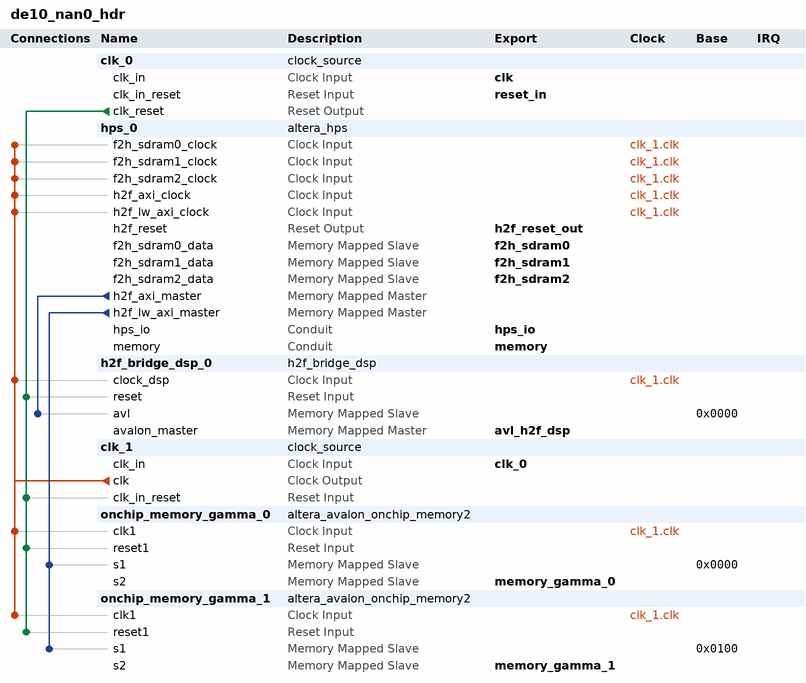
[diagram p0: system contents]
# Platform Designer (Qsys) system de10_nan0_hdr, Cyclone V 5CSEBA6U23I7
# Parameters at their usual value, and those the tool derives, are not listed.
package require -exact qsys 17.1
create_system de10_nan0_hdr
set_project_property DEVICE_FAMILY {Cyclone V}
set_project_property DEVICE 5CSEBA6U23I7

add_instance clk_0 clock_source 17.1
set_instance_parameter_value clk_0 clockFrequency 50000000

add_instance hps_0 altera_hps 17.1
set_instance_parameter_value hps_0 EMAC1_Mode RGMII
set_instance_parameter_value hps_0 EMAC1_PinMuxing {HPS I/O Set 0}
set_instance_parameter_value hps_0 F2SCLK_COLDRST_Enable false
set_instance_parameter_value hps_0 F2SCLK_DBGRST_Enable false
set_instance_parameter_value hps_0 F2SCLK_WARMRST_Enable false
set_instance_parameter_value hps_0 F2SDRAM_Type {Avalon-MM Write-Only,Avalon-MM Read-Only,Avalon-MM Write-Only}
set_instance_parameter_value hps_0 F2SDRAM_Width 64,32,32
set_instance_parameter_value hps_0 F2SINTERRUPT_Enable false
set_instance_parameter_value hps_0 F2S_Width 0
set_instance_parameter_value hps_0 FPGA_PERIPHERAL_OUTPUT_CLOCK_FREQ_EMAC0_GTX_CLK 125
set_instance_parameter_value hps_0 FPGA_PERIPHERAL_OUTPUT_CLOCK_FREQ_EMAC0_MD_CLK 2.5
set_instance_parameter_value hps_0 FPGA_PERIPHERAL_OUTPUT_CLOCK_FREQ_EMAC1_GTX_CLK 125
set_instance_parameter_value hps_0 FPGA_PERIPHERAL_OUTPUT_CLOCK_FREQ_EMAC1_MD_CLK 2.5
set_instance_parameter_value hps_0 HPS_PROTOCOL DDR3
set_instance_parameter_value hps_0 I2C0_Mode I2C
set_instance_parameter_value hps_0 I2C0_PinMuxing {HPS I/O Set 0}
set_instance_parameter_value hps_0 I2C1_Mode I2C
set_instance_parameter_value hps_0 I2C1_PinMuxing {HPS I/O Set 0}
set_instance_parameter_value hps_0 LWH2F_Enable true
set_instance_parameter_value hps_0 MEM_BANKADDR_WIDTH 3
set_instance_parameter_value hps_0 MEM_CLK_FREQ 400.0
set_instance_parameter_value hps_0 MEM_COL_ADDR_WIDTH 10
set_instance_parameter_value hps_0 MEM_DQ_WIDTH 32
set_instance_parameter_value hps_0 MEM_DRV_STR RZQ/6
set_instance_parameter_value hps_0 MEM_ROW_ADDR_WIDTH 15
set_instance_parameter_value hps_0 MEM_RTT_NOM RZQ/6
set_instance_parameter_value hps_0 MEM_RTT_WR {Dynamic ODT off}
set_instance_parameter_value hps_0 MEM_TCL 7
set_instance_parameter_value hps_0 MEM_TFAW_NS 37.5
set_instance_parameter_value hps_0 MEM_TRAS_NS 35.0
set_instance_parameter_value hps_0 MEM_TRCD_NS 13.75
set_instance_parameter_value hps_0 MEM_TRFC_NS 300.0
set_instance_parameter_value hps_0 MEM_TRP_NS 13.75
set_instance_parameter_value hps_0 MEM_VENDOR Other
set_instance_parameter_value hps_0 MEM_WTCL 7
set_instance_parameter_value hps_0 QSPI_Mode N/A
set_instance_parameter_value hps_0 QSPI_PinMuxing Unused
set_instance_parameter_value hps_0 REF_CLK_FREQ 25.0
set_instance_parameter_value hps_0 S2FCLK_USER2CLK 5
set_instance_parameter_value hps_0 S2F_Width 1
set_instance_parameter_value hps_0 SDIO_Mode {4-bit Data}
set_instance_parameter_value hps_0 SDIO_PinMuxing {HPS I/O Set 0}
set_instance_parameter_value hps_0 SPIM1_Mode {Single Slave Select}
set_instance_parameter_value hps_0 SPIM1_PinMuxing {HPS I/O Set 0}
set_instance_parameter_value hps_0 STM_Enable false
set_instance_parameter_value hps_0 TIMING_BOARD_AC_SKEW 0.02
set_instance_parameter_value hps_0 TIMING_BOARD_AC_TO_CK_SKEW 0.0
set_instance_parameter_value hps_0 TIMING_BOARD_DQ_TO_DQS_SKEW 0.0
set_instance_parameter_value hps_0 TIMING_BOARD_MAX_CK_DELAY 0.6
set_instance_parameter_value hps_0 TIMING_BOARD_MAX_DQS_DELAY 0.6
set_instance_parameter_value hps_0 TIMING_BOARD_SKEW_BETWEEN_DQS 0.02
set_instance_parameter_value hps_0 TIMING_BOARD_SKEW_CKDQS_DIMM_MAX 0.01
set_instance_parameter_value hps_0 TIMING_BOARD_SKEW_CKDQS_DIMM_MIN -0.01
set_instance_parameter_value hps_0 TIMING_BOARD_SKEW_WITHIN_DQS 0.02
set_instance_parameter_value hps_0 TIMING_TDH 125
set_instance_parameter_value hps_0 TIMING_TDQSCK 400
set_instance_parameter_value hps_0 TIMING_TDQSQ 120
set_instance_parameter_value hps_0 TIMING_TDS 50
set_instance_parameter_value hps_0 TIMING_TIH 250
set_instance_parameter_value hps_0 TIMING_TIS 175
set_instance_parameter_value hps_0 TIMING_TQSH 0.38
set_instance_parameter_value hps_0 UART0_Mode {No Flow Control}
set_instance_parameter_value hps_0 UART0_PinMuxing {HPS I/O Set 0}
set_instance_parameter_value hps_0 USB1_Mode SDR
set_instance_parameter_value hps_0 USB1_PinMuxing {HPS I/O Set 0}
set_instance_parameter_value hps_0 desired_cfg_clk_mhz 100.0
set_instance_parameter_value hps_0 desired_qspi_clk_mhz 400.0

add_instance h2f_bridge_dsp_0 h2f_bridge_dsp 1.0
set_instance_parameter_value h2f_bridge_dsp_0 WIDTH_ADDR 16
set_instance_parameter_value h2f_bridge_dsp_0 WIDTH_BE 4
set_instance_parameter_value h2f_bridge_dsp_0 WIDTH_DATA 32

add_instance clk_1 clock_source 17.1
set_instance_parameter_value clk_1 clockFrequency 100000000

add_instance onchip_memory_gamma_0 altera_avalon_onchip_memory2 17.1
set_instance_parameter_value onchip_memory_gamma_0 dataWidth 8
set_instance_parameter_value onchip_memory_gamma_0 dualPort true
set_instance_parameter_value onchip_memory_gamma_0 initMemContent false
set_instance_parameter_value onchip_memory_gamma_0 initializationFileName onchip_mem.hex
set_instance_parameter_value onchip_memory_gamma_0 memorySize 256
set_instance_parameter_value onchip_memory_gamma_0 singleClockOperation true

add_instance onchip_memory_gamma_1 altera_avalon_onchip_memory2 17.1
set_instance_parameter_value onchip_memory_gamma_1 dataWidth 8
set_instance_parameter_value onchip_memory_gamma_1 dualPort true
set_instance_parameter_value onchip_memory_gamma_1 initMemContent false
set_instance_parameter_value onchip_memory_gamma_1 initializationFileName onchip_mem.hex
set_instance_parameter_value onchip_memory_gamma_1 memorySize 256
set_instance_parameter_value onchip_memory_gamma_1 singleClockOperation true

# connections
add_connection clk_1.clk h2f_bridge_dsp_0.clock_dsp clock
add_connection clk_1.clk hps_0.f2h_sdram0_clock clock
add_connection clk_1.clk hps_0.f2h_sdram1_clock clock
add_connection clk_1.clk hps_0.f2h_sdram2_clock clock
add_connection clk_1.clk hps_0.h2f_axi_clock clock
add_connection clk_1.clk hps_0.h2f_lw_axi_clock clock
add_connection clk_1.clk onchip_memory_gamma_0.clk1 clock
add_connection clk_1.clk onchip_memory_gamma_1.clk1 clock
add_connection clk_0.clk_reset clk_1.clk_in_reset reset
add_connection clk_0.clk_reset h2f_bridge_dsp_0.reset reset
add_connection clk_0.clk_reset onchip_memory_gamma_0.reset1 reset
add_connection clk_0.clk_reset onchip_memory_gamma_1.reset1 reset
add_connection hps_0.h2f_axi_master h2f_bridge_dsp_0.avl avalon
set_connection_parameter_value hps_0.h2f_axi_master/h2f_bridge_dsp_0.avl baseAddress 0x0000
add_connection hps_0.h2f_lw_axi_master onchip_memory_gamma_0.s1 avalon
set_connection_parameter_value hps_0.h2f_lw_axi_master/onchip_memory_gamma_0.s1 baseAddress 0x0000
add_connection hps_0.h2f_lw_axi_master onchip_memory_gamma_1.s1 avalon
set_connection_parameter_value hps_0.h2f_lw_axi_master/onchip_memory_gamma_1.s1 baseAddress 0x0100

# exported interfaces
add_interface avl_h2f_dsp avalon master
set_interface_property avl_h2f_dsp EXPORT_OF h2f_bridge_dsp_0.avalon_master
add_interface clk clock sink
set_interface_property clk EXPORT_OF clk_0.clk_in
add_interface clk_0 clock sink
set_interface_property clk_0 EXPORT_OF clk_1.clk_in
add_interface f2h_sdram0 avalon slave
set_interface_property f2h_sdram0 EXPORT_OF hps_0.f2h_sdram0_data
add_interface f2h_sdram1 avalon slave
set_interface_property f2h_sdram1 EXPORT_OF hps_0.f2h_sdram1_data
add_interface f2h_sdram2 avalon slave
set_interface_property f2h_sdram2 EXPORT_OF hps_0.f2h_sdram2_data
add_interface h2f_reset_out reset source
set_interface_property h2f_reset_out EXPORT_OF hps_0.h2f_reset
add_interface hps_io conduit end
set_interface_property hps_io EXPORT_OF hps_0.hps_io
add_interface memory conduit end
set_interface_property memory EXPORT_OF hps_0.memory
add_interface memory_gamma_0 avalon slave
set_interface_property memory_gamma_0 EXPORT_OF onchip_memory_gamma_0.s2
add_interface memory_gamma_1 avalon slave
set_interface_property memory_gamma_1 EXPORT_OF onchip_memory_gamma_1.s2
add_interface reset_in reset sink
set_interface_property reset_in EXPORT_OF clk_0.clk_in_reset

set_interconnect_requirement {$system} qsys_mm.clockCrossingAdapter HANDSHAKE
set_interconnect_requirement {$system} qsys_mm.enableEccProtection FALSE
set_interconnect_requirement {$system} qsys_mm.insertDefaultSlave FALSE
set_interconnect_requirement {$system} qsys_mm.maxAdditionalLatency 1

save_system de10_nan0_hdr.qsys
